# EAGLE design arduinoJhon (EAGLE 9.6.2)
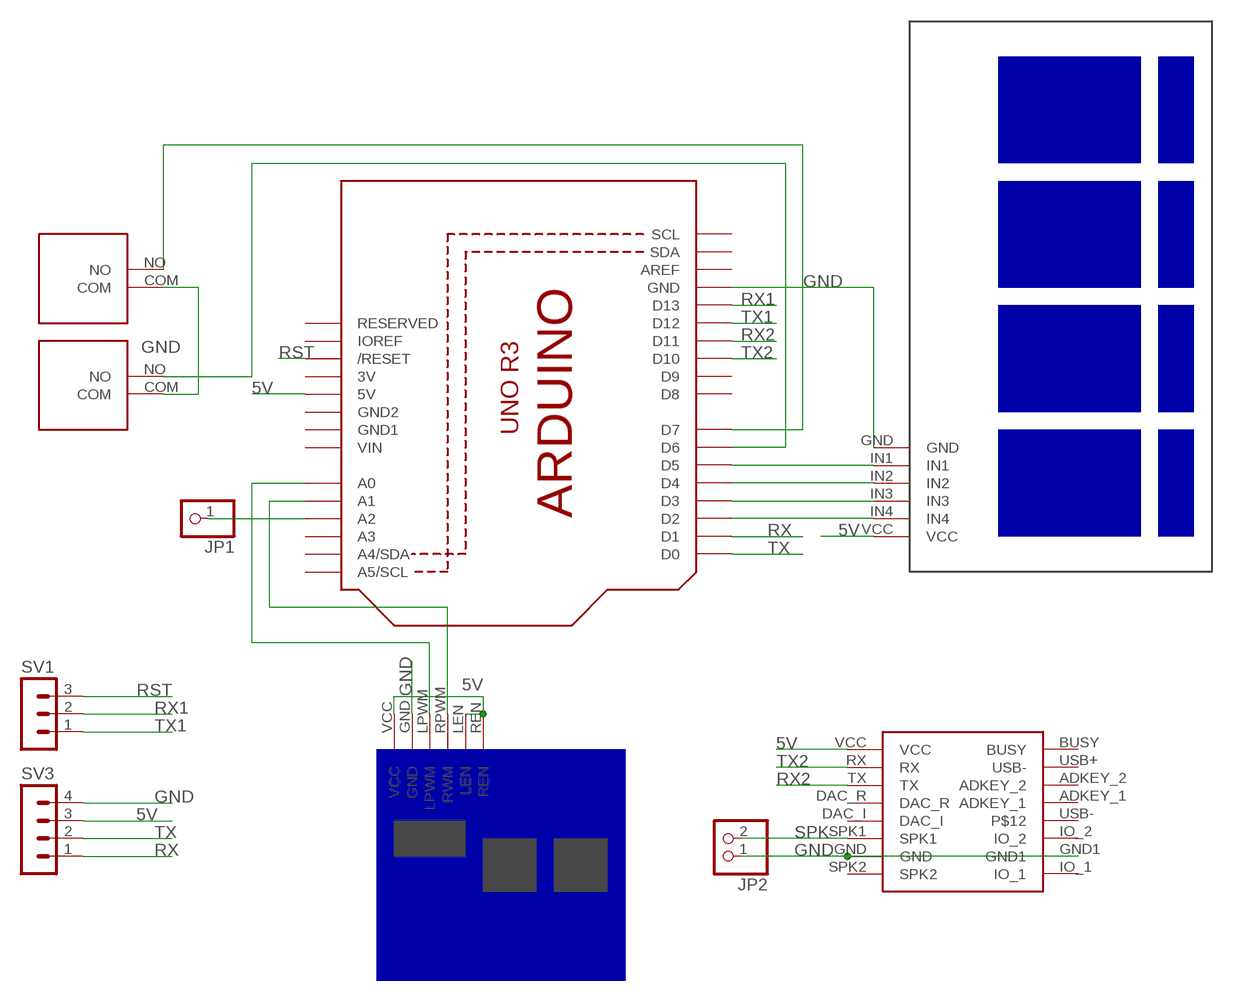
[diagram p0: schematic, sheet 1]

## Parts
JP1  PINHD-1X1  [1X01]
JP2  PINHD-1X2  [1X02]
SV1  MA03-1  [MA03-1]
SV3  MA04-1  [MA04-1]
U$1  DFPLAYER_MINI  [DFPLAYER_MINI]
U$2  ARDUINO_UNO  [ARDUINO_UNO]
U$9  RELAY_4CHANNEL  [RELAY_4CHANNEL]
U$10  MOTOR_DRIVER_BTS7960  [MOTOR_DRIVER_BTS7960]
U$11  SWITCHLIMITER  [SWICHLIMITER]
U$12  SWITCHLIMITER  [SWICHLIMITER]

## Nets
5V: SV3.3 U$1.VCC U$2.5V U$9.VCC U$10.LEN U$10.REN U$10.VCC
GND: JP2.1 SV3.4 U$1.GND U$1.GND1 U$2.GND U$9.GND U$10.GND U$11.COM U$12.COM
N$1: JP1.1 U$2.A2
N$12: U$2.D2 U$9.IN4
N$13: U$2.D3 U$9.IN3
N$17: U$2.D4 U$9.IN2
N$21: U$2.D5 U$9.IN1
N$23: U$2.D6 U$12.NO
N$24: U$2.A0 U$10.LPWM
N$25: U$2.A1 U$10.RPWM(RWM)
N$26: U$2.D7 U$11.NO
RST: SV1.3 U$2.RESET(/RESET)
RX: SV3.1 U$2.D1
RX1: SV1.2 U$2.D13
RX2: U$1.TX U$2.D11
SPK: JP2.2 U$1.SPK1
TX: SV3.2 U$2.D0
TX1: SV1.1 U$2.D12
TX2: U$1.RX U$2.D10
Unconnected: U$1.ADKEY_1 U$1.ADKEY_2 U$1.BUSY U$1.DAC_I U$1.DAC_R U$1.IO_1 U$1.IO_2 U$1.SPK2 U$1.USB+(USB-) U$1.USB- U$2.A3 U$2.A4(A4/SDA) U$2.A5(A5/SCL) U$2.AREF U$2.D8 U$2.D9 U$2.IOREF U$2.RESERVED U$2.SCL U$2.SDA

## Power pins joined to a net without a drawn wire
3V: U$2.3V
GND1: U$2.GND1
GND2: U$2.GND2
VIN: U$2.VIN

## Library data of the parts
JP1 = adafruit:PINHD-1X1: Pin header 1x1 for 0.1" spacing With round pins
JP2 = pinhead:PINHD-1X2: PIN HEADER
SV1 = con-lstb:MA03-1: PIN HEADER; OC_FARNELL: unknown; OC_NEWARK: unknown
SV3 = con-lstb:MA04-1: PIN HEADER; OC_FARNELL: unknown; OC_NEWARK: unknown
U$1 = FusionLocal v17:DFPLAYER_MINI
U$2 = FusionLocal:ARDUINO_UNO
U$9 = LocalLib:RELAY_4CHANNEL
U$10 = LocalLib:MOTOR_DRIVER_BTS7960
U$11 U$12 = LocalLib:SWITCHLIMITER

## Board
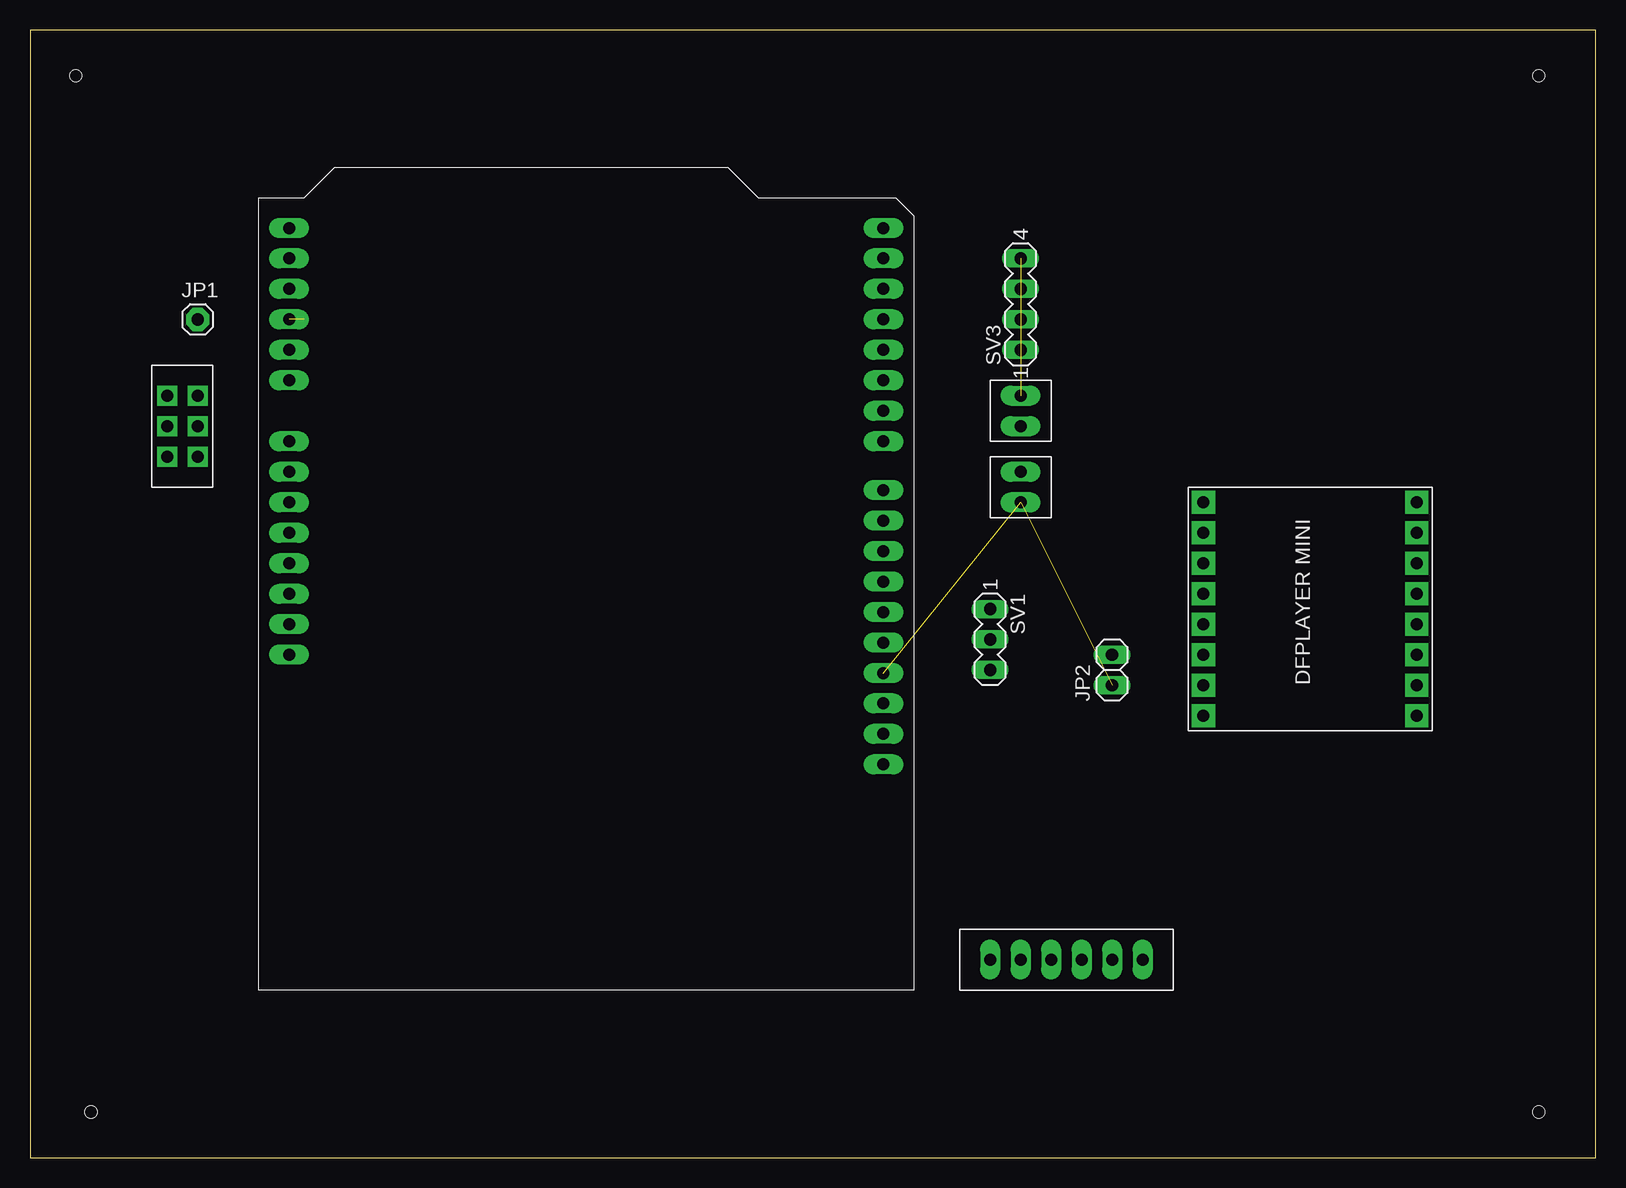
[diagram p1: board, top side]
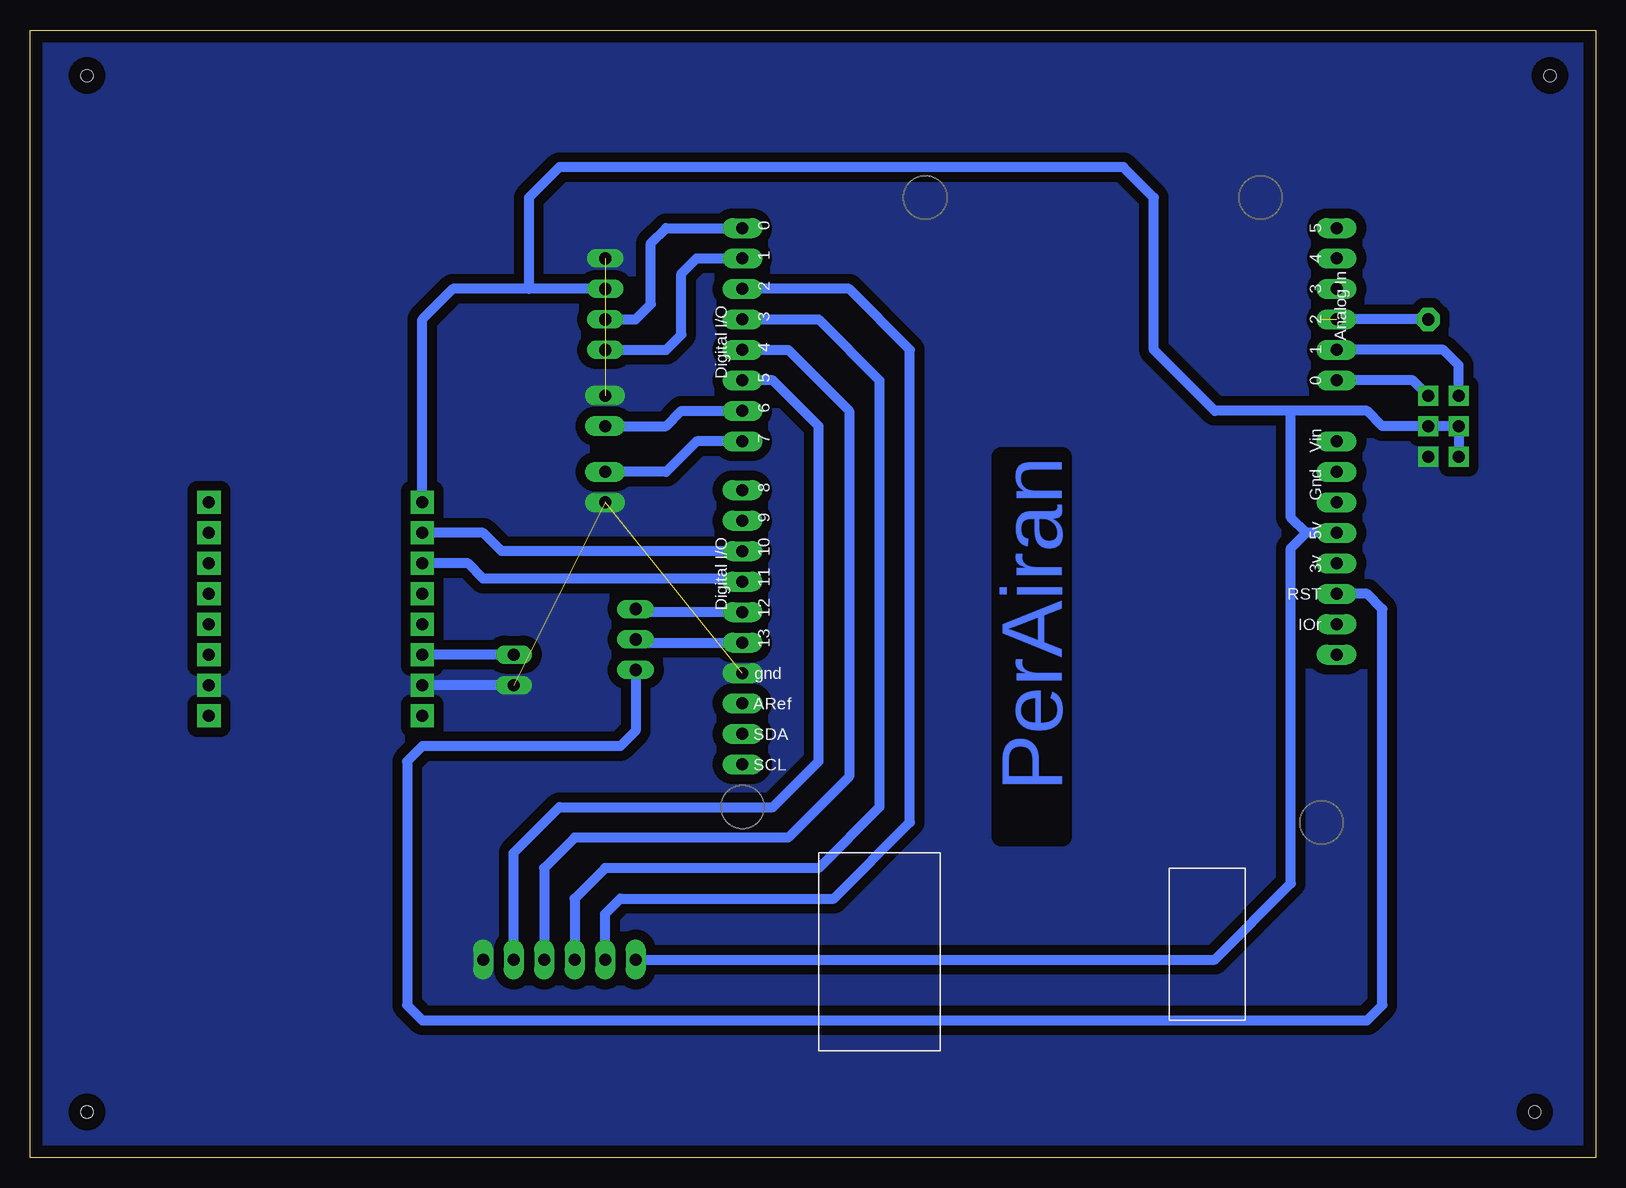
[diagram p2: board, bottom side, seen from below]

Size 130.48 x 93.97 mm. Coordinates in mm from the lower left corner, seen from the top.
Outline: 0,0 130.48,0 130.48,93.97 0,93.97 0,0
Copper layers (1*16): Top 0.035mm / dielectric 1.5mm / Bottom 0.035mm
Design rules "default": minimum track width 6mil, minimum drill 0.35mm, track to track 6mil, track to pad 6mil, pad to pad 6mil, via to via 6mil, smd to smd 6mil, copper to edge 40mil, drill to drill 6mil, minimum pad ring 10mil, minimum via ring 8mil, stop-mask expansion 4mil, vias tented up to drill 0mil, thermal gap 10mil
Holes 1 mm at 3.81,90.17 5.08,3.81 125.73,90.17 125.73,3.81

### Footprints (pad centres in the part's own frame; a part is rotated, then mirrored left to right if it is on the bottom)
1X01 = drill 1.016 pad 1.93 octagon: 1 0,0
1X02 = drill 1.016 long: 1 -1.27,0; 2 1.27,0
MA03-1 = drill 1.016 long: 1 -2.54,0; 2 0,0; 3 2.54,0
MA04-1 = drill 1.016 long: 1 -3.81,0; 2 -1.27,0; 3 1.27,0; 4 3.81,0
DFPLAYER_MINI = drill 1 pad 1.93 square: ADKEY_1 19.05,8.89; ADKEY_2 19.05,11.43; BUSY 19.05,19.05; DAC_I 1.27,8.89; DAC_R 1.27,11.43; GND 1.27,3.81; GND1 19.05,3.81; IO_1 19.05,1.27; IO_2 19.05,6.35; RX 1.27,16.51; SPK1 1.27,6.35; SPK2 1.27,1.27; TX 1.27,13.97; USB+ 19.05,13.97; USB- 19.05,16.51; VCC 1.27,19.05
ARDUINO_UNO = drill 1 pad 1.676 long: 3V -35.56,2.54; 5V -38.1,2.54; A0 -50.8,2.54; A1 -53.34,2.54; A2 -55.88,2.54; A3 -58.42,2.54; A4 -60.96,2.54; A5 -63.5,2.54; AREF -23.876,52.07; D0 -63.5,52.07; D1 -60.96,52.07; D2 -58.42,52.07; D3 -55.88,52.07; D4 -53.34,52.07; D5 -50.8,52.07; D6 -48.26,52.07; D7 -45.72,52.07; D8 -41.656,52.07; D9 -39.116,52.07; D10 -36.576,52.07; D11 -34.036,52.07; D12 -31.496,52.07; D13 -28.956,52.07; GND -26.416,52.07; GND1 -43.18,2.54; GND2 -40.64,2.54; IOREF -30.48,2.54; RESERVED -27.94,2.54; RESET -33.02,2.54; SCL -18.796,52.07; SDA -21.336,52.07; VIN -45.72,2.54
RELAY_4CHANNEL = drill 1 pad 1.676 long: GND -15.24,2.54; IN1 -12.7,2.54; IN2 -10.16,2.54; IN3 -7.62,2.54; IN4 -5.08,2.54; VCC -2.54,2.54
MOTOR_DRIVER_BTS7960 = drill 1 pad 1.676 square: GND -2.54,3.81; LEN -5.08,3.81; LPWM -7.62,3.81; REN -5.08,1.27; RPWM -7.62,1.27; VCC -2.54,1.27
SWICHLIMITER = drill 1 pad 1.676 long: COM -3.81,2.54; NO -1.27,2.54

### Placement (x,y rotation side)
JP1  13.97,69.85 0 top
JP2  90.17,40.64 90 top
SV1  80.01,43.18 270 top
SV3  82.55,71.12 90 top
U$1  96.52,35.56 0 top
U$2  19.05,13.97 270 top
U$9  77.47,19.05 180 top
U$10  10.16,55.88 270 top
U$11  85.09,58.42 90 top
U$12  80.01,59.69 270 top

### Tracks (layer width: path | path; a pad name or v marks a point on that pad's centre or on a via)
5V
  Bottom 0.813: U$10.VCC U$10.REN U$10.LEN 17.78,60.96 19.05,62.23 25.4,62.23 | U$9.VCC 31.75,16.51 25.4,22.86 25.4,50.8 24.13,52.07 | U$1.VCC 97.79,69.85 95.25,72.39 88.9,72.39 | SV3.3 88.9,72.39 | 25.4,62.23 31.75,62.23 36.83,67.31 36.83,80.01 39.37,82.55 86.36,82.55 88.9,80.01 88.9,72.39 | U$2.5V 24.13,52.07 | 24.13,52.07 25.4,53.34 25.4,62.23
GND  (3 unrouted)
  Bottom 0.813: JP2.1 U$1.GND
  pour Bottom (isolate 0.813, no thermals): 1.27,93.98 132.08,93.98 132.08,1.27 0,1.27 0,93.98
N$1  (1 unrouted)
  Bottom 0.813: JP1.1 22.86,69.85
N$12
  Bottom 0.813: U$9.IN4 82.55,20.32 81.28,21.59 63.5,21.59 57.15,27.94 57.15,67.31 62.23,72.39 U$2.D2
N$13
  Bottom 0.813: U$2.D3 64.77,69.85 59.69,64.77 59.69,29.21 64.77,24.13 82.55,24.13 85.09,21.59 U$9.IN3
N$17
  Bottom 0.813: U$2.D4 67.31,67.31 62.23,62.23 62.23,31.75 67.31,26.67 85.09,26.67 87.63,24.13 U$9.IN2
N$21
  Bottom 0.813: U$9.IN1 90.17,25.4 86.36,29.21 68.58,29.21 64.77,33.02 64.77,60.96 68.58,64.77 U$2.D5
N$23
  Bottom 0.813: U$12.NO 77.47,60.96 76.2,62.23 U$2.D6
N$24
  Bottom 0.813: U$10.LPWM 15.24,64.77 U$2.A0
N$25
  Bottom 0.813: U$10.RPWM 11.43,66.04 12.7,67.31 U$2.A1
N$26
  Bottom 0.813: U$11.NO 77.47,57.15 74.93,59.69 U$2.D7
RST
  Bottom 0.813: SV1.3 80.01,35.56 81.28,34.29 97.79,34.29 99.06,33.02 99.06,12.7 97.79,11.43 19.05,11.43 17.78,12.7 17.78,45.72 19.05,46.99 U$2.RESET
RX
  Bottom 0.813: SV3.1 77.47,67.31 76.2,68.58 76.2,73.66 74.93,74.93 U$2.D1
RX1
  Bottom 0.813: SV1.2 79.76,42.93 U$2.D13
RX2
  Bottom 0.813: U$2.D11 71.37,48.26 92.71,48.26 93.98,49.53 U$1.TX
SPK
  Bottom 0.813: JP2.2 U$1.SPK1
TX
  Bottom 0.813: SV3.2 80.01,69.85 78.74,71.12 78.74,76.2 77.47,77.47 U$2.D0
TX1
  Bottom 0.813: U$2.D12 79.76,45.47 SV1.1
TX2
  Bottom 0.813: U$2.D10 91.19,50.55 92.71,52.07 U$1.RX

### Text on the board
Bottom: PerAiran